# EAGLE design bsides2017 (EAGLE 8.2.2)
GCN: 1; PCBNAME: BMD-300 BB Adapter; PROJECT: BMD-300
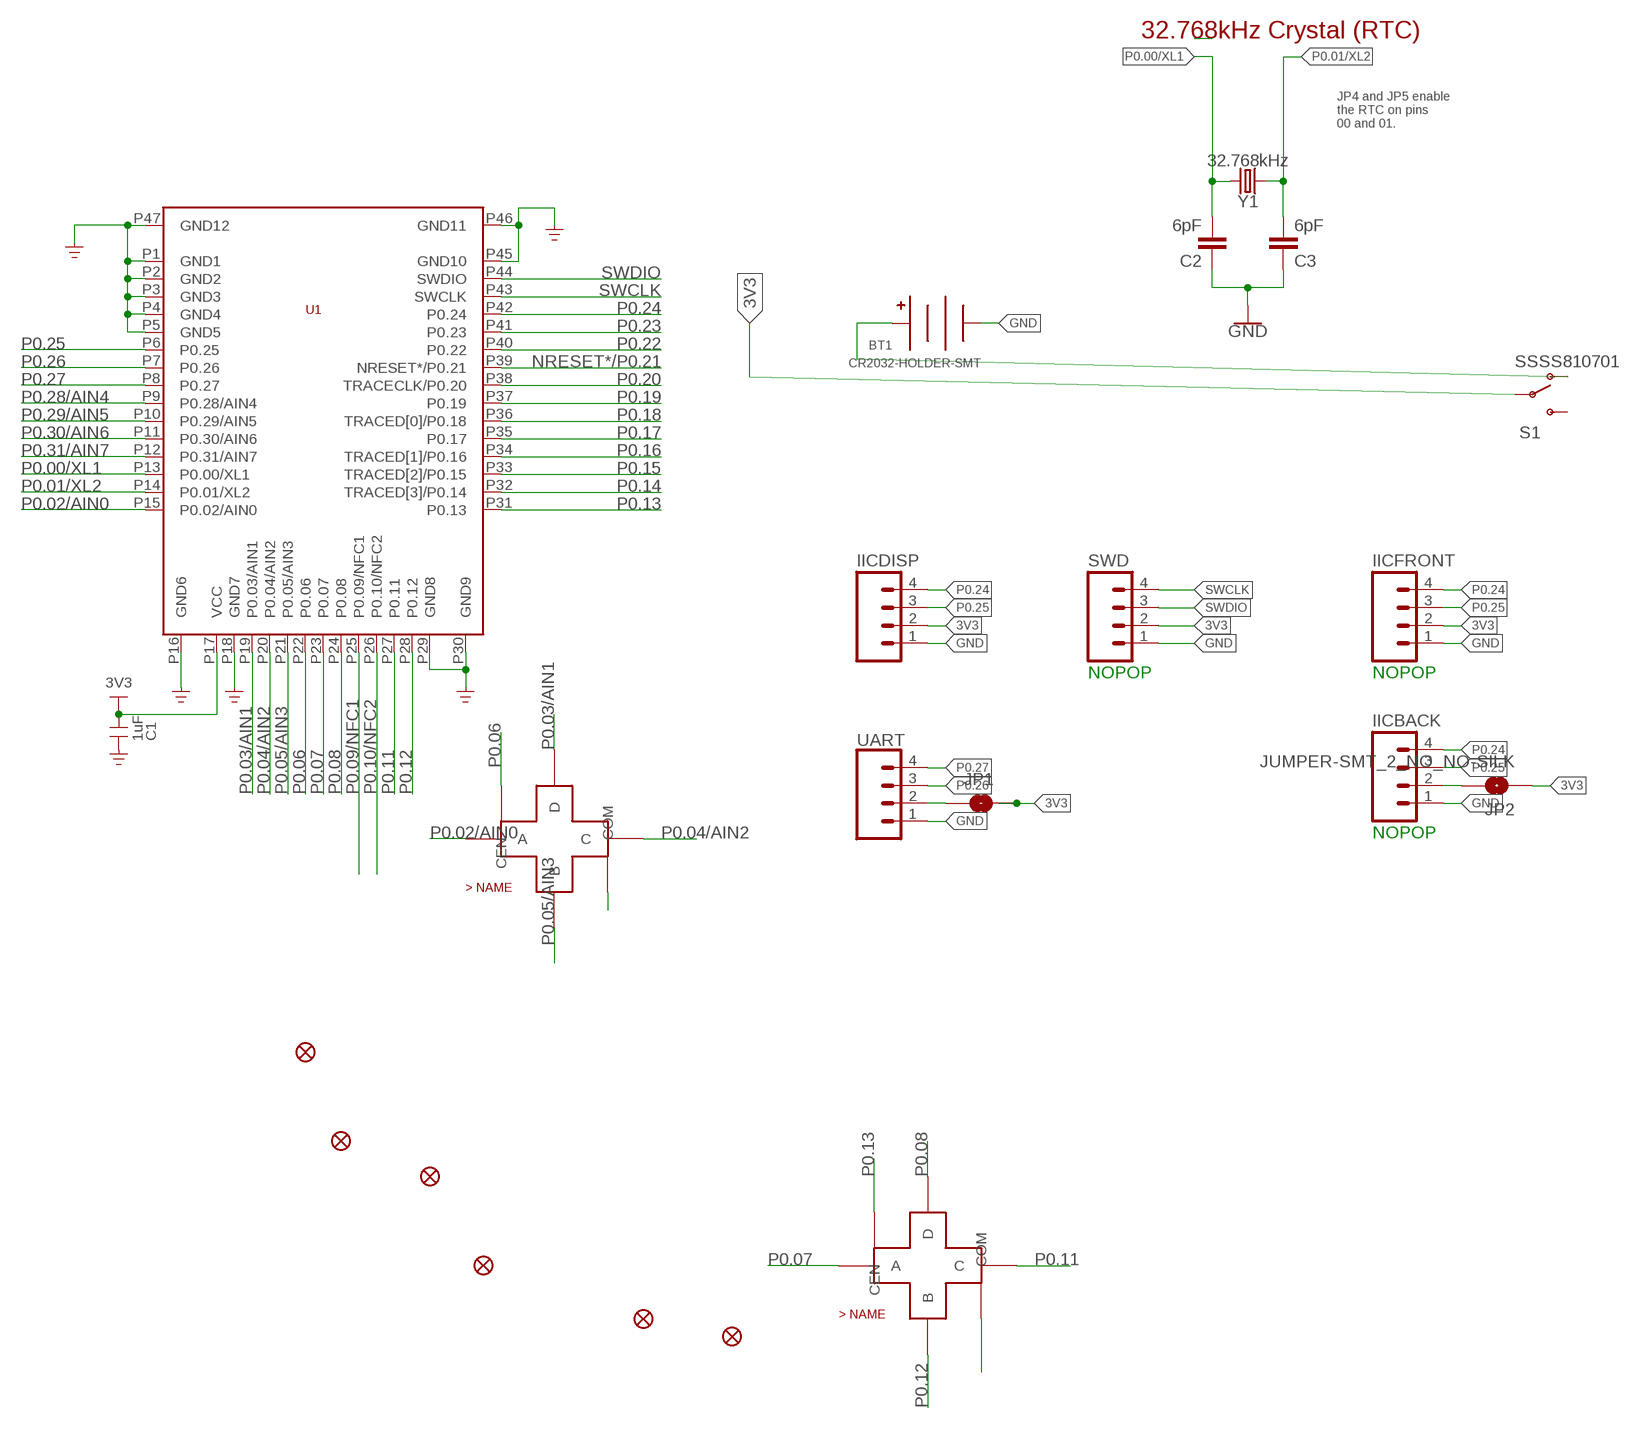
[diagram p0: schematic, sheet 1]

## Parts
BT1  CR2032-HOLDER-SMT  [S8211-46R]
C1  1uF  C-0603  [SMD0603]
C2  6pF  15PF-0402-50V-5%  [0402]
C3  6pF  15PF-0402-50V-5%  [0402]
FID1  FIDUCIAL1X2  [FIDUCIAL-1X2]
FID2  FIDUCIAL1X2  [FIDUCIAL-1X2]
FID3  FIDUCIAL1X2  [FIDUCIAL-1X2]
FID4  FIDUCIAL1X2  [FIDUCIAL-1X2]
FID5  FIDUCIAL1X2  [FIDUCIAL-1X2]
FID6  FIDUCIAL1X2  [FIDUCIAL-1X2]
IICBACK  M04LOCK  [1X04_LOCK@1]
IICDISP  M04LOCK  [1X04_LOCK@1]
IICFRONT  M04LOCK  [1X04_LOCK@1]
JP1  JUMPER-SMT_2_NO_NO-SILK  [SMT-JUMPER_2_NO_NO-SILK]
JP2  JUMPER-SMT_2_NO_NO-SILK  [SMT-JUMPER_2_NO_NO-SILK]
S1  SSSS810701  [SSSS8]
SWD  M04LOCK  [1X04_LOCK@1]
U1  BMD-300  [BMD-300]
U$6  SKRHABE010  [SKRHABE010]
U$7  SKRHABE010  [SKRHABE010]
UART  CONN_04SMD  [1X04_SMD_RA_MALE]
Y1  32.768kHz  CRYSTAL-32.768KHZSMD-3.2X1.5  [CRYSTAL-SMD-3.2X1.5MM]

## Nets
3V3 [power]: C1.2 IICDISP.2 IICFRONT.2 JP1.2 JP2.1 S1.P$2(P) SWD.2 U1.P17(VCC)
GND [power]: BT1.NEG C1.1 C2.1 C3.1 IICBACK.1 IICDISP.1 IICFRONT.1 SWD.1 U1.P1(GND1) U1.P2(GND2) U1.P3(GND3) U1.P4(GND4) U1.P5(GND5) U1.P16(GND6) U1.P18(GND7) U1.P29(GND8) U1.P30(GND9) U1.P45(GND10) U1.P46(GND11) U1.P47(GND12) U$6.P$5(COM) U$6.P$7(COM) U$6.P$8(COM) U$7.P$5(COM) U$7.P$7(COM) U$7.P$8(COM) UART.1
N$1 [power]: IICBACK.2 JP2.2
N$2 [power]: BT1.POS0(POS) BT1.POS1(POS) S1.P$3(O)
N$13 [power]: JP1.1 UART.2
NRESET*/P0.21: U1.P39(NRESET*/P0.21)
P0.00/XL1: C2.2 U1.P13(P0.00/XL1) Y1.P$2
P0.01/XL2: C3.2 U1.P14(P0.01/XL2) Y1.P$1
P0.02/AIN0: U1.P15(P0.02/AIN0) U$6.P$1(A)
P0.03/AIN1: U1.P19(P0.03/AIN1) U$6.P$6(D)
P0.04/AIN2: U1.P20(P0.04/AIN2) U$6.P$3(C)
P0.05/AIN3: U1.P21(P0.05/AIN3) U$6.P$4(B)
P0.06: U1.P22(P0.06) U$6.P$2(CEN)
P0.07: U1.P23(P0.07) U$7.P$1(A)
P0.08: U1.P24(P0.08) U$7.P$6(D)
P0.09/NFC1: U1.P25(P0.09/NFC1)
P0.10/NFC2: U1.P26(P0.10/NFC2)
P0.11: U1.P27(P0.11) U$7.P$3(C)
P0.12: U1.P28(P0.12) U$7.P$4(B)
P0.13: U1.P31(P0.13) U$7.P$2(CEN)
P0.14: U1.P32(TRACED[3]/P0.14)
P0.15: U1.P33(TRACED[2]/P0.15)
P0.16: U1.P34(TRACED[1]/P0.16)
P0.17: U1.P35(P0.17)
P0.18: U1.P36(TRACED[0]/P0.18)
P0.19: U1.P37(P0.19)
P0.20: U1.P38(TRACECLK/P0.20)
P0.22: U1.P40(P0.22)
P0.23: U1.P41(P0.23)
P0.24: IICBACK.4 IICDISP.4 IICFRONT.4 U1.P42(P0.24)
P0.25: IICBACK.3 IICDISP.3 IICFRONT.3 U1.P6(P0.25)
P0.26: U1.P7(P0.26) UART.3
P0.27: U1.P8(P0.27) UART.4
P0.28/AIN4: U1.P9(P0.28/AIN4)
P0.29/AIN5: U1.P10(P0.29/AIN5)
P0.30/AIN6: U1.P11(P0.30/AIN6)
P0.31/AIN7: U1.P12(P0.31/AIN7)
SWCLK: SWD.4 U1.P43(SWCLK)
SWDIO: SWD.3 U1.P44(SWDIO)
Unconnected: S1.P$1(S)

## Notes on the sheet
- 32.768kHz Crystal (RTC)
- JP4 and JP5 enable
  the RTC on pins
  00 and 01.
- NOPOP | NOPOP
- NOPOP

## Library data of the parts
BT1 = battery-holder:CR2032-HOLDER: CR2016/CR2032 (20mm) Battery Holder S8211-46R: SMT holder - https://www.harwin.com/products/S8211-46R/
C1 = c:C; DESCRIPTION: CAP CER 1UF 6.3V 10% X5R 0603; EACH: .008; HEIGHT: 0.9MM; MFPN: CL10A105KQ8NNNC; MFR: Samsung; VEND: Digikey; VPN: 1276-1036-2-ND
C2 C3 = SparkFun-Capacitors:15PF: 15pF ceramic capacitors A capacitor is a passive two-terminal electrical component used to store electrical energy temporarily in an electric field.; PROD_ID: CAP-13063; VALUE: 15pF
FID1-FID6 = SparkFun-Aesthetics:FIDUCIAL: Fiducial Alignment Points Various fiducial points for machine vision alignment.
IICBACK IICDISP IICFRONT SWD = SparkFun-Connectors:M04: Header 4 Standard 4-pin 0.1" header. Use with straight break away headers (SKU : PRT-00116), right angle break away headers (PRT-00553), swiss pins (PRT-00743), machine pins (PRT-00117), and female headers (PRT-00115). Molex polarized connector foot print use with SKU : PRT-08231 with associated crimp pins and housings. 1MM SMD Version SKU: PRT-10208
JP1 JP2 = SparkFun-Jumpers:JUMPER-SMT_2_NO: Normally open jumper This jumper has two pads in close proximity to each other. Apply solder to close the connection. Round pads are easier to solder for beginners, but are a lot larger. SparkFun Product that uses the round pads: SparkFun EL Sequencer <https://www.sparkfun.com/products/12781>
S1 = badger:SSSS810701: ALSP SSSS810701
U1 = BMD-300:BMD-300
U$6 U$7 = badger:SKRHABE010
UART = SparkFun-Connectors:CONN_04: Multi connection point. Often used as Generic Header-pin footprint for 0.1 inch spaced/style header connections On any of the 0.1 inch spaced packages, you can populate with these: Break Away Headers - Straight <https://www.sparkfun.com/products/116> (PRT-00116) Break Away Male Headers - Right Angle <https://www.sparkfun.com/products/553> (PRT-00553) Female Headers <https://www.sparkfun.com/products/115> (PRT-00115) Break Away Headers - Machine Pin <https://www.sparkfun.com/products/117> (PRT-00117) Break Away Female Headers - Swiss Machine Pin <https://www.sparkfun.com/products/743> (PRT-00743) For SCREWTERMINALS and SPRING TERMINALS visit here: Screw Terimnals on SparkFun.com <https://www.sparkfun.com/search/results?term=Screw+Terminals> (5mm/3.5mm/2.54mm spacing) This device is also useful as a general connection point to wire up your design to another part of your project. Our various solder wires solder well into these plated through hole pads. Hook-Up Wire - Assortment (Stranded, 22 AWG) <https://www.sparkfun.com/products/11375> (PRT-11375) Hook-Up Wire - Assortment (Solid Core, 22 AWG) <https://www.sparkfun.com/products/11367> (PRT-11367) View the entire wire category on our website here <https://www.sparkfun.com/categories/141> Special notes: Molex polarized connector foot print use with SKU : PRT-08231 with associated crimp pins and housings. 1MM SMD Version SKU: PRT-10208; PROD_ID: CONN-09140; SF_ID: PRT-12638
Y1 = SparkFun-Clocks:CRYSTAL-32.768KHZ: 32.768kHz Crystal Frequency: 32.768kHz Frequency Stability: ±20ppm Load Capacitance: 12.5pF (PTH-2X6 & SMD-3.2X1.5), 6pF (SMD-2X6); PROD_ID: XTAL-13062

## Net classes
1 power: width 0.508 mm, clearance 0.254 mm

## Board
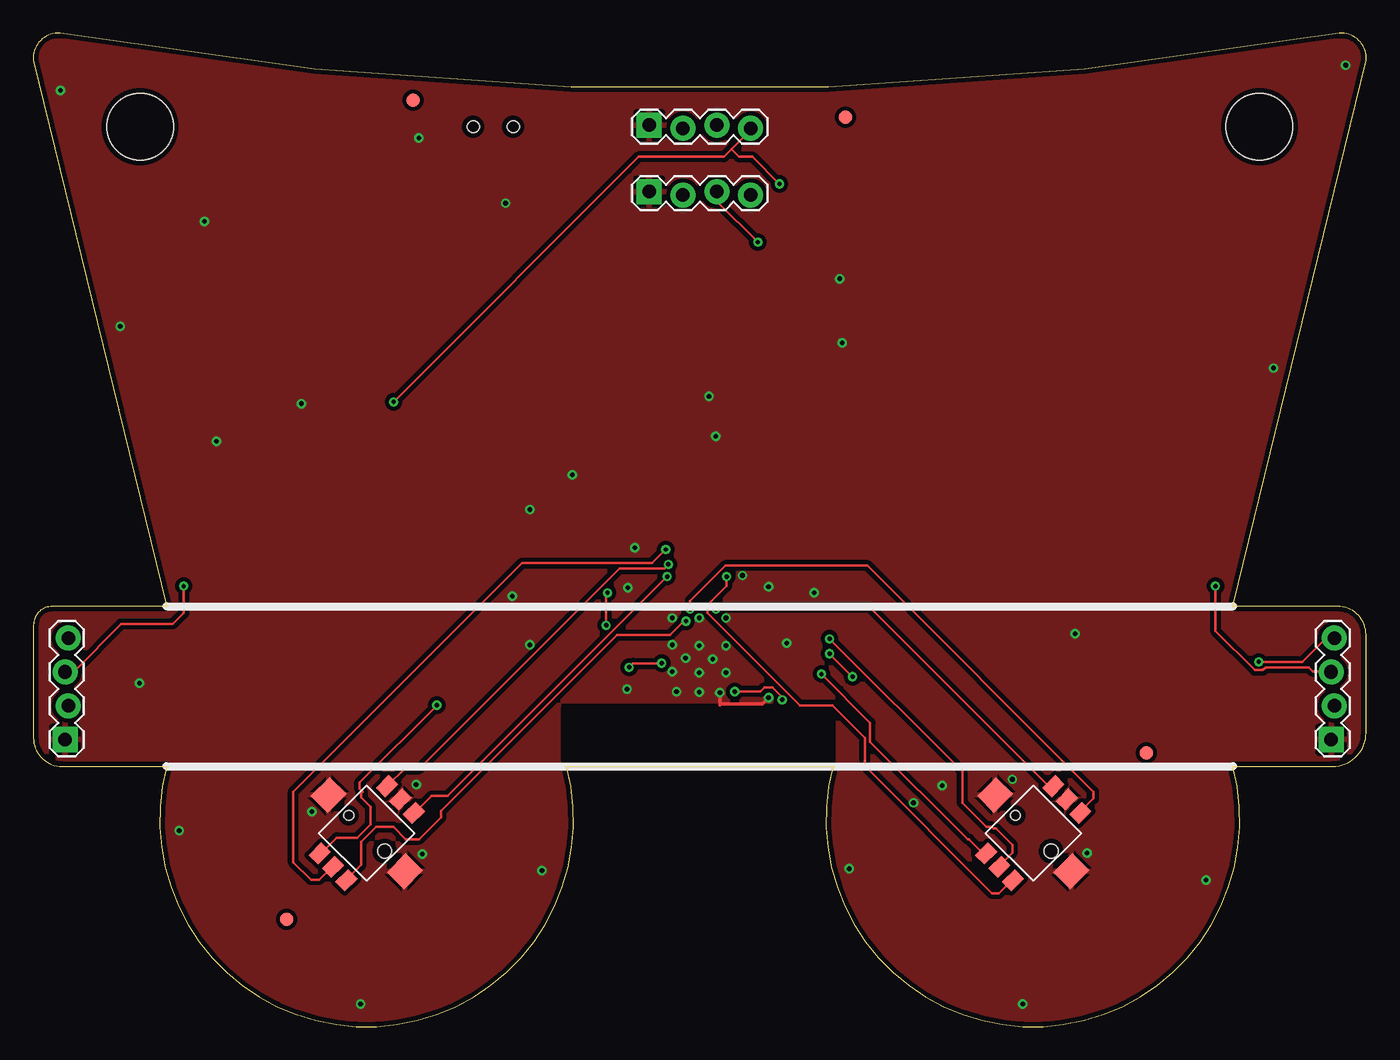
[diagram p1: board, top side]
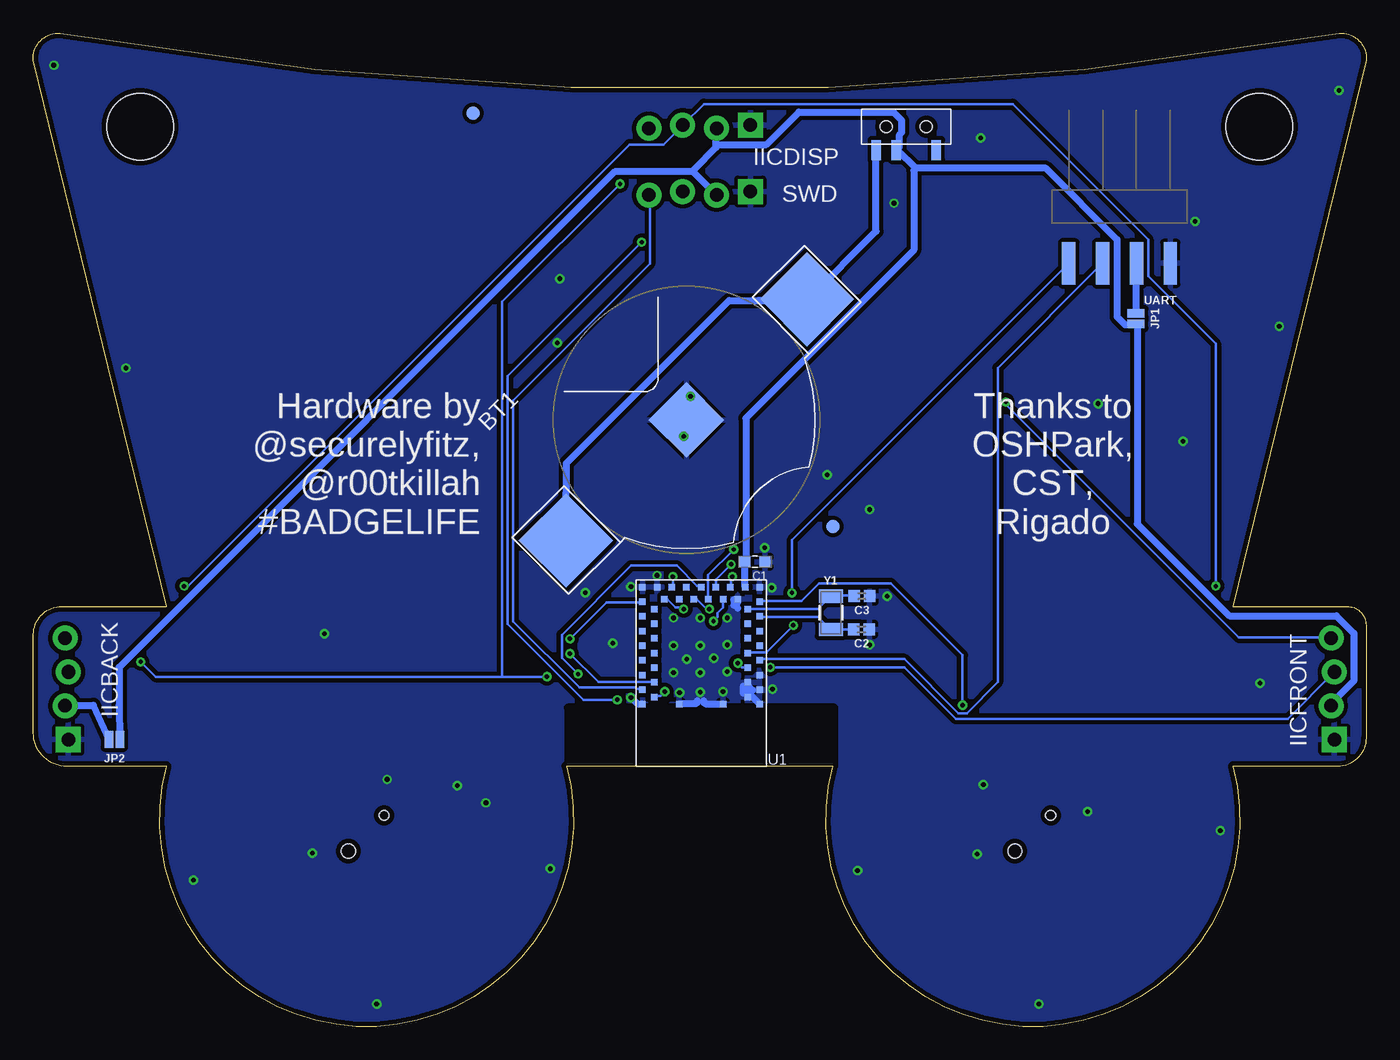
[diagram p2: board, bottom side, seen from below]

Size 100.01 x 74.54 mm. Coordinates in mm from the lower left corner, seen from the top.
Outline: 90.01,19.53 97.51,19.53 arc90 100.01,22.03 100.01,29.41 arc90 97.89,31.53 90.01,31.53 100.01,72.53 arc100 98.01,74.53 arc-20 2.01,74.53 arc100 0.01,72.53 10.01,31.53 1.42,31.53 arc90 0.01,30.12 0.01,21.65 arc90 2.13,19.53 10.01,19.53 arc210 40.01,19.53 60.01,19.53 arc210 90.01,19.53
Copper layers (1*16): Top 0.0356mm / dielectric 1.5011mm / Bottom 0.0356mm
Design rules "LaenPCBOrder *": minimum track width 8mil, minimum drill 13mil, track to track 8mil, track to pad 6mil, pad to pad 6mil, via to via 6mil, smd to smd 6mil, copper to edge 15mil, drill to drill 6mil, minimum pad ring 7mil, minimum via ring 7mil, stop-mask expansion 3mil, vias tented up to drill 25mil, thermal gap 10mil
Holes 5 mm at 8.01,67.53 92.01,67.53
bKeepout: area 47,24.5 to 53,31.5

### Footprints (pad centres in the part's own frame; a part is rotated, then mirrored left to right if it is on the bottom)
S8211-46R = smd 4 x 4: NEG 0,0 | smd 5 x 5: POS0 -12.8,0; POS1 12.8,0
SMD0603 = smd 0.8 x 0.8: 1 -0.75,0; 2 0.75,0
0402 = smd 0.85 x 0.9: 1 -0.58,0; 2 0.58,0
FIDUCIAL-1X2 = smd 1 x 1: 1 0,0
1X04_LOCK@1 = drill 1.016 pad 1.88 square: 1 0,0.127 | drill 1.016 pad 1.88: 2 2.54,-0.127; 3 5.08,0.127; 4 7.62,-0.127
SMT-JUMPER_2_NO_NO-SILK = smd 0.635 x 1.27: 1 -0.406,0; 2 0.406,0
SSSS8 = smd 0.7 x 1.5: P$1 -2.25,1.75; P$2 0.75,1.75; P$3 2.25,1.75 | hole 0.9: -1.5,0; 1.5,0
BMD-300 = smd 0.49 x 0.49: P1 0.5,9.35; P2 1.4,8.8; P3 0.5,8.25; P4 1.4,7.7; P5 0.5,7.15; P6 1.4,6.6; P7 0.5,6.05; P8 1.4,5.5; P9 0.5,4.95; P10 1.4,4.4; P11 0.5,3.85; P12 1.4,3.3; P13 0.5,2.75; P14 1.4,2.2; P15 0.5,1.65; P16 0.5,0.55; P17 1.6,0.55; P18 2.15,1.45; P19 2.7,0.55; P20 3.25,1.45; P21 3.8,0.55; P22 4.35,1.45; P23 4.9,0.55; P24 5.45,1.45; P25 6,0.55; P26 6.55,1.45; P27 7.1,0.55; P28 7.65,1.45; P29 8.2,0.55; P30 9.3,0.55; P31 9.3,1.65; P32 8.4,2.2; P33 9.3,2.75; P34 8.4,3.3; P35 9.3,3.85; P36 8.4,4.4; P37 9.3,4.95; P38 8.4,5.5; P39 9.3,6.05; P40 8.4,6.6; P41 9.3,7.15; P42 8.4,7.7; P43 9.3,8.25; P44 8.4,8.8; P45 9.3,9.35; P46 6.55,9.35; P47 3.25,9.35
SKRHABE010 = smd 1.35 x 1 rotated 45: P$1 -3.536,-1.52; P$2 -2.528,-2.528; P$3 -1.52,-3.536; P$4 1.52,3.536; P$5 2.528,2.528; P$6 3.536,1.52 | smd 2 x 1.8 rotated 45: P$7 -2.864,2.864; P$8 2.864,-2.864 | hole 0.75: -1.343,1.343 | hole 1.05: 1.343,-1.343
1X04_SMD_RA_MALE = smd 1 x 3.17: 1 -3.81,4.25; 2 -1.27,4.25; 3 1.27,4.25; 4 3.81,4.25
CRYSTAL-SMD-3.2X1.5MM = smd 1 x 1.8: P$1 -1.25,0; P$2 1.25,0

### Placement (x,y rotation side)
BT1  51.01,45.53 225 bottom
C1  45.86,34.88 180 bottom
C2  37.87,29.81 180 bottom
C3  37.85,32.3 180 bottom
FID1  40.01,37.53 0 bottom
FID2  60.95,68.26 0 top
FID3  83.51,20.53 0 top
FID4  19.01,8.03 0 top
FID5  28.51,69.53 0 top
FID6  67.01,68.53 90 bottom
IICBACK  97.51,21.53 90 top
IICDISP  46.21,67.53 0 top
IICFRONT  2.51,21.53 90 top
JP1  17.28,53.13 270 bottom
JP2  93.93,21.56 180 bottom
S1  34.51,67.53 180 bottom
SWD  46.21,62.53 0 top
U1  45.01,33.53 180 bottom
U$6  25.02,14.51 0 top
U$7  75.03,14.51 0 top
UART  18.51,61.53 180 bottom
Y1  40.17,31.05 270 bottom

### Tracks (layer width: path | path; a pad name or v marks a point on that pad's centre or on a via)
3V3
  Bottom 0.508: U1.P17 46.64,33.06 46.64,34.78 C1.2 46.54,35.09 46.54,45.66 33.94,58.25 33.94,64.25 33.84,64.45 | 33.84,64.45 24.09,64.45 18.7,59.07 18.7,53.28 18.09,52.67 17.28,52.67 JP1.2 17.18,52.46 17.18,37.73 10.27,30.82 2.24,30.82 0.92,29.5 0.92,25.95 2.55,24.32 2.55,24.12 IICFRONT.2 | 33.84,64.45 35.16,65.77 S1.P$2 35.06,65.98 35.06,66.89 34.86,67.09 34.86,68.01 35.46,68.62 42.58,68.62 45.02,66.18 48.77,66.18 | 50.5,64.15 56.39,64.15 93.58,26.96 93.58,24.12 JP2.1 | 50.5,64.15 48.77,62.42 SWD.2 | 48.77,66.18 48.77,65.98 50.4,64.35 50.5,64.15 | 48.77,66.18 48.77,67.4 IICDISP.2
GND  (via drill 0.35)
  Top 0.254: v55.17,24.67 54.71,24.21 51.59,24.21 51.52,24.15 v51.52,25.06
  Bottom 0.508: U1.P1 45.52,24.22 46.74,25.44 46.74,25.54 46.34,25.54 46.03,25.23 46.13,25.13 46.34,25.13 46.64,25.44 46.74,25.34 46.74,25.03 46.44,25.03 46.34,24.93 U1.P2 | U1.P47 48.27,24.22 49.59,24.22 49.69,24.32 49.69,24.44 | U1.P46 51.52,24.22 50.3,24.22 50.2,24.32 50.2,24.44 | U1.P45 54.36,24.22 54.67,24.22 55.07,24.62 v55.17,24.67 | U1.P18 47.15,32.04 47.15,31.84 47.35,31.64 47.45,31.64 47.45,32.04 47.35,32.04 47.25,31.94 47.25,31.84 47.35,31.74 47.25,31.64 47.25,31.53 47.16,31.38
  other vias: 44.55,25.32 48.27,25.12 55.17,33 53.21,33.85 44.62,32.94 45.14,35.93 47.94,30.66 49.96,30.66 51.98,30.66 47.94,28.64 49.96,28.58 51.98,28.58 47.94,26.62 49.96,26.56 51.98,26.56 35.94,32.29 37.26,28.64 10.95,14.7 24.56,1.68 38.17,11.71 61.23,11.84 74.25,1.68 87.99,10.99 93.07,49.42 98.48,72.14 2.03,70.26 6.52,52.54 60.7,51.3 40.45,41.41 12.84,60.42 78.18,29.47 37.26,38.8 7.95,25.77 56.54,28.77 20.91,16.14 29.18,12.95 28.73,18.16 79.07,13.01 73.47,18.55 68.19,18.09 66.04,16.79 13.75,43.93 20.11,46.75 60.51,56.12 35.44,61.79 28.92,66.67 48.94,27.63 50.97,27.56 49.96,25.09 58.59,32.57 50.7,47.3 51.2,44.3
  pour Bottom (isolate 0.305): 0.01,-0.47 0.01,74.53 100.01,74.53 100.01,-0.47
  pour Top (isolate 0.305): 0.01,-0.47 0.01,74.53 100.01,74.53 100.01,-0.47
N$1
  Bottom 0.508: JP2.2 95.51,24.12 97.54,24.12 IICBACK.2
N$2
  Bottom 0.508: S1.P$3 36.79,65.77 36.79,59.68 41.87,54.6 BT1.POS0 42.17,54.5 45.34,54.5 | 45.34,54.5 45.62,54.5 | BT1.POS1 60.05,36.51 60.05,40.07 60.02,40.1 60.02,42.27 47.8,54.5 45.34,54.5
N$13
  Bottom 0.508: JP1.1 17.28,53.58 17.28,57.24 UART.2
P0.00/XL1
  Bottom 0.203: U1.P13 45.42,30.72 41.15,30.72 40.24,29.81 Y1.P$2 40.14,29.81 38.51,29.81 C2.2
P0.01/XL2
  Bottom 0.203: U1.P14 46.34,31.33 41.15,31.33 40.24,32.24 Y1.P$1 40.14,32.35 38.51,32.35 C3.2
P0.02/AIN0  (via drill 0.33)
  Top 0.203: v30.28,24.12 24.49,18.33 24.49,17.82 24.7,17.61 24.59,17.51 24.59,17.21 25.3,16.5 25.3,15.18 24.29,14.16 22.76,14.16 21.55,12.94 U$6.P$1
  Bottom 0.203: v30.28,24.12 30.28,27.88 35.67,33.26 41.05,33.26 42.37,31.94 45.42,31.94 U1.P15
P0.03/AIN1  (via drill 0.33)
  Top 0.203: v47.56,33.77 31.1,17.31 29.88,17.31 28.56,15.99 U$6.P$6
  Bottom 0.203: v47.56,33.77 47.66,33.67 47.66,33.06 U1.P19
P0.04/AIN2  (via drill 0.33)
  Top 0.203: v48.98,30.42 48.77,30.42 47.76,29.4 43.8,29.4 30.59,16.19 30.59,15.68 28.96,14.06 27.95,14.06 27.03,14.97 25.71,14.97 24.59,13.86 24.59,12.13 23.48,11.01 U$6.P$3
  Bottom 0.203: v48.98,30.42 48.67,30.72 48.67,31.03 48.27,31.43 48.27,32.04 U1.P20
P0.05/AIN3  (via drill 0.33)
  Top 0.203: v47.66,34.68 47.35,34.38 44,34.38 28.96,19.34 27.84,19.34 26.63,18.12 U$6.P$4
  Bottom 0.203: v47.66,34.68 48.77,33.57 48.77,33.06 U1.P21
P0.06  (via drill 0.33)
  Top 0.203: v47.45,35.8 46.44,34.78 36.68,34.78 19.51,17.61 19.51,12.33 20.83,11.01 21.44,11.01 22.46,12.03 U$6.P$2
  Bottom 0.203: v47.45,35.8 49.38,33.87 49.38,32.14 U1.P22
P0.07  (via drill 0.33)
  Top 0.203: v59.14,26.45 62.8,22.8 62.8,21.37 70.11,14.06 70.21,14.06 71.23,13.04 71.43,13.04 U$7.P$1
  Bottom 0.203: v59.14,26.45 60.36,27.67 60.36,29.4 55.18,34.58 51.72,34.58 50.2,33.06 49.99,33.06 U1.P23
P0.08  (via drill 0.33)
  Top 0.203: v49.28,31.33 49.28,31.94 51.92,34.58 62.59,34.58 79.56,17.61 79.56,17.11 78.54,16.09 U$7.P$6
  Bottom 0.203: v49.28,31.33 49.49,31.33 50.2,32.04 50.4,32.04 U1.P24
P0.11  (via drill 0.33)
  Top 0.203: v52.03,33.77 52.03,33.06 50.6,31.64 50.6,31.03 57.51,24.12 59.95,24.12 62.39,21.68 62.39,19.54 71.94,9.99 72.45,9.99 73.46,11.01 U$7.P$3
  Bottom 0.203: v52.03,33.77 52.03,33.06 U1.P27
P0.12  (via drill 0.33)
  Top 0.203: v51.21,31.33 51.62,31.33 51.72,31.43 62.8,31.43 76.1,18.12 76.51,18.12 U$7.P$4
  Bottom 0.203: v51.21,31.33 51.31,31.43 51.82,31.43 52.43,32.04 52.64,32.04 U1.P28
P0.13  (via drill 0.33)
  Top 0.203: v59.75,29.1 69.7,19.14 69.7,16.8 71.53,14.97 71.94,14.97 72.04,14.87 72.24,14.87 73.46,13.65 73.46,13.04 72.45,12.03 U$7.P$2
  Bottom 0.203: v59.75,29.1 57,31.84 54.36,31.84 U1.P31
P0.24  (via drill 0.33)
  Top 0.203: v61.47,26.25 v59.75,27.98 | v91.95,27.37 95.21,27.37 96.93,29.1 97.54,29.1 IICBACK.4 | v27.03,46.88 45.42,65.26 51.82,65.26 52.38,65.82 | 52.38,65.82 53.75,67.2 53.75,67.4 IICDISP.4 | v55.99,63.23 53.96,65.26 52.94,65.26 52.38,65.82
  Bottom 0.203: v59.75,27.98 57.61,25.84 53.45,25.84 U1.P42 | 64.83,26.25 90.84,26.25 v91.95,27.37 | 64.83,26.25 v61.47,26.25 | v27.03,46.88 27.03,46.67 9.56,29.2 2.65,29.2 IICFRONT.4 | 64.83,26.25 64.83,54.39 v55.99,63.23
P0.25  (via drill 0.33)
  Top 0.203: v47.15,27.27 45.02,27.27 v44.71,26.96 | v88.7,33.06 88.7,29.7 91.65,26.76 92.26,26.76 92.46,26.96 95.71,26.96 96.02,26.66 97.34,26.66 IICBACK.3 | v11.28,33.06 11.28,31.03 10.47,30.21 6.61,30.21 3.05,26.66 2.44,26.66 IICFRONT.3
  Bottom 0.203: v47.15,27.27 46.84,26.96 46.44,26.96 U1.P6 | v44.71,26.96 34.65,26.96 30.79,23.1 5.9,23.1 2.44,26.56 IICFRONT.3 | v88.7,33.06 88.4,33.06 55.28,66.18 52.74,66.18 51.31,67.6 IICDISP.3 51.21,67.7 49.69,69.23 26.52,69.23 16.36,59.07 16.36,56.32 11.28,51.24 v11.28,33.06
P0.26
  Bottom 0.203: U1.P7 45.42,27.57 34.65,27.57 30.59,23.51 29.98,23.51 27.64,25.84 27.64,49.42 19.82,57.24 UART.3
P0.27  (via drill 0.33)
  Top 0.203: v42.98,30.11 42.98,32.45 v43.08,32.55
  Bottom 0.203: v42.98,30.11 45.02,28.08 46.34,28.08 U1.P8 | v43.08,32.55 43.08,36.51 22.36,57.24 UART.4
SWCLK
  Bottom 0.203: U1.P43 54.36,25.34 54.77,25.34 54.87,25.44 59.04,25.44 64.01,30.42 64.01,46.98 53.75,57.24 53.75,62.32 SWD.4
SWDIO  (via drill 0.33)
  Top 0.203: v52.64,25.13 54.57,25.13 54.87,25.44 55.48,25.44 56.19,24.73 v56.19,24.52 | v54.36,58.86 51.31,61.91 51.31,62.62 SWD.3
  Bottom 0.203: v52.64,25.13 52.94,24.83 53.35,24.83 U1.P44 | v56.19,24.52 58.73,24.52 64.42,30.21 64.42,48.81 v54.36,58.86

### Text on the board
bNames: Thanks to / OSHPark, / CST, / Rigado | Hardware by / @securelyfitz, / @r00tkillah / #BADGELIFE